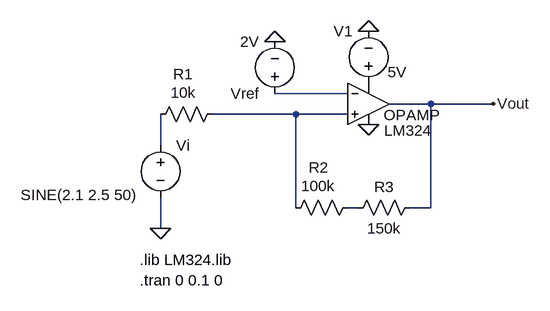
[diagram p0: schematic Zero Crossing Detector.asc]
Zero Crossing Detector.asc, the LTspice schematic file:
Version 4
SHEET 1 1984 2980
WIRE -64 352 -176 352
WIRE 64 368 0 368
WIRE 160 368 64 368
WIRE -144 384 -272 384
WIRE -64 384 -144 384
WIRE -352 432 -352 384
WIRE -144 528 -144 384
WIRE -48 528 -64 528
WIRE 64 528 64 368
WIRE 64 528 32 528
WIRE -352 560 -352 512
FLAG -32 256 0
FLAG -176 272 0
FLAG -32 400 0
FLAG 160 368 Vout
FLAG -352 560 0
SYMBOL voltage -32 352 R180
WINDOW 0 24 96 Left 2
WINDOW 3 -59 33 Left 2
SYMATTR InstName V1
SYMATTR Value 5V
SYMBOL voltage -176 368 R180
WINDOW 123 0 0 Left 0
WINDOW 39 0 0 Left 0
SYMATTR InstName Vref
SYMATTR Value 2V
SYMBOL Opamps/opamp2 -32 304 R0
WINDOW 0 23 81 Left 2
WINDOW 3 24 105 Left 2
SYMATTR InstName OPAMP
SYMATTR Value LM324
SYMBOL res -48 512 R90
WINDOW 0 -30 61 VBottom 2
WINDOW 3 -2 61 VBottom 2
SYMATTR InstName R2
SYMATTR Value 100k
SYMBOL voltage -352 416 R0
WINDOW 39 0 0 Left 0
WINDOW 3 -215 92 Left 2
SYMATTR InstName Vi
SYMATTR Value SINE(2.1 2.5 50)
SYMATTR Value2 AC 1 0
SYMBOL res -256 368 R90
WINDOW 0 -30 61 VBottom 2
WINDOW 3 -2 61 VBottom 2
SYMATTR InstName R1
SYMATTR Value 10k
SYMBOL res 48 512 R90
WINDOW 0 0 56 VBottom 2
WINDOW 3 32 56 VTop 2
SYMATTR InstName R3
SYMATTR Value 150k
TEXT -384 608 Left 2 !.lib LM324.lib
TEXT -384 640 Left 2 !.tran 0 0.1 0

The netlist it stands for:
* Zero Crossing Detector.asc
V1 P001 0 5V
Vref N001 0 2V
XOPAMP N002 N001 P001 0 Vout LM324  ; pins In+ In- V+ V- OUT
R2 N004 N002 100k
Vi N003 0 SINE(2.1 2.5 50) AC 1 0
R1 N002 N003 10k
R3 Vout N004 150k
.lib LM324.lib
.tran 0 0.1 0
.backanno
.end